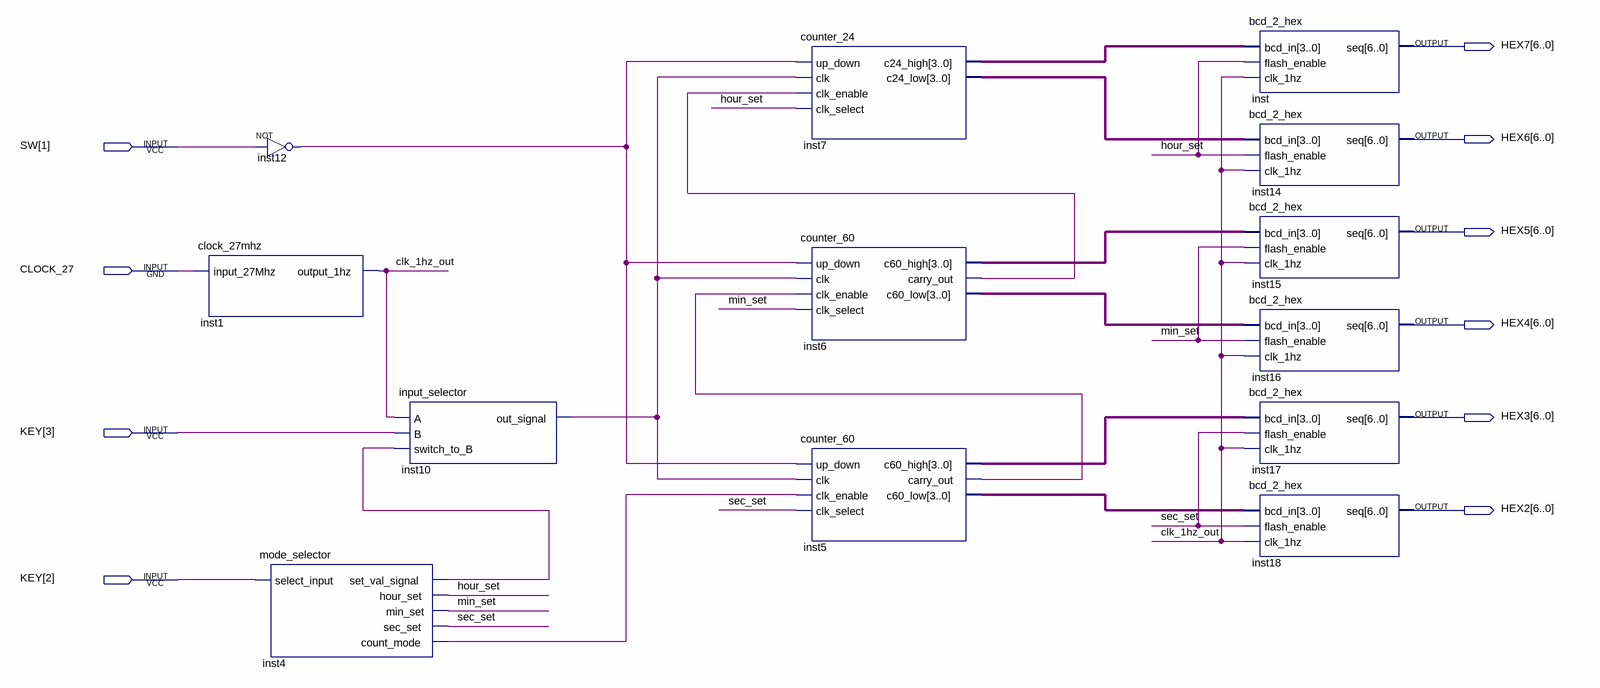
[diagram p0: schematic sheet]
// Quartus schematic hard_counter.bdf as structural Verilog: 13 symbols, 10 pins
module hard_counter (
  input  [1:1] SW,
  input  CLOCK_27,
  input  [3:2] KEY,
  output [6:0] HEX7,
  output [6:0] HEX6,
  output [6:0] HEX5,
  output [6:0] HEX4,
  output [6:0] HEX3,
  output [6:0] HEX2
);

  wire clk_1hz_out, hour_set, inst4_count_mode, inst4_set_val_signal, inst5_carry_out, inst6_carry_out,
       inst10_out_signal, inst12_out, min_set, sec_set;
  wire [3:0] inst5_c60_high, inst5_c60_low, inst6_c60_high, inst6_c60_low, inst7_c24_high, inst7_c24_low;

  clock_27mhz inst1 (.input_27Mhz(CLOCK_27), .output_1hz(clk_1hz_out));
  not inst12 (inst12_out, SW[1]);
  mode_selector inst4 (
    .select_input(KEY[2]), .set_val_signal(inst4_set_val_signal), .hour_set(hour_set), .min_set(min_set),
    .sec_set(sec_set), .count_mode(inst4_count_mode));
  input_selector inst10 (
    .A(clk_1hz_out), .B(KEY[3]), .switch_to_B(inst4_set_val_signal), .out_signal(inst10_out_signal));
  counter_24 inst7 (
    .up_down(inst12_out), .clk(inst10_out_signal), .clk_enable(inst6_carry_out), .clk_select(hour_set),
    .c24_high(inst7_c24_high), .c24_low(inst7_c24_low));
  counter_60 inst6 (
    .up_down(inst12_out), .clk(inst10_out_signal), .clk_enable(inst5_carry_out), .clk_select(min_set),
    .c60_high(inst6_c60_high), .carry_out(inst6_carry_out), .c60_low(inst6_c60_low));
  counter_60 inst5 (
    .up_down(inst12_out), .clk(inst10_out_signal), .clk_enable(inst4_count_mode), .clk_select(sec_set),
    .c60_high(inst5_c60_high), .carry_out(inst5_carry_out), .c60_low(inst5_c60_low));
  bcd_2_hex inst (.bcd_in(inst7_c24_high), .flash_enable(hour_set), .clk_1hz(clk_1hz_out), .seq(HEX7));
  bcd_2_hex inst14 (.bcd_in(inst7_c24_low), .flash_enable(hour_set), .clk_1hz(clk_1hz_out), .seq(HEX6));
  bcd_2_hex inst15 (.bcd_in(inst6_c60_high), .flash_enable(min_set), .clk_1hz(clk_1hz_out), .seq(HEX5));
  bcd_2_hex inst16 (.bcd_in(inst6_c60_low), .flash_enable(min_set), .clk_1hz(clk_1hz_out), .seq(HEX4));
  bcd_2_hex inst17 (.bcd_in(inst5_c60_high), .flash_enable(sec_set), .clk_1hz(clk_1hz_out), .seq(HEX3));
  bcd_2_hex inst18 (.bcd_in(inst5_c60_low), .flash_enable(sec_set), .clk_1hz(clk_1hz_out), .seq(HEX2));
endmodule
